# Altium project Bike_Comp.PrjPCB
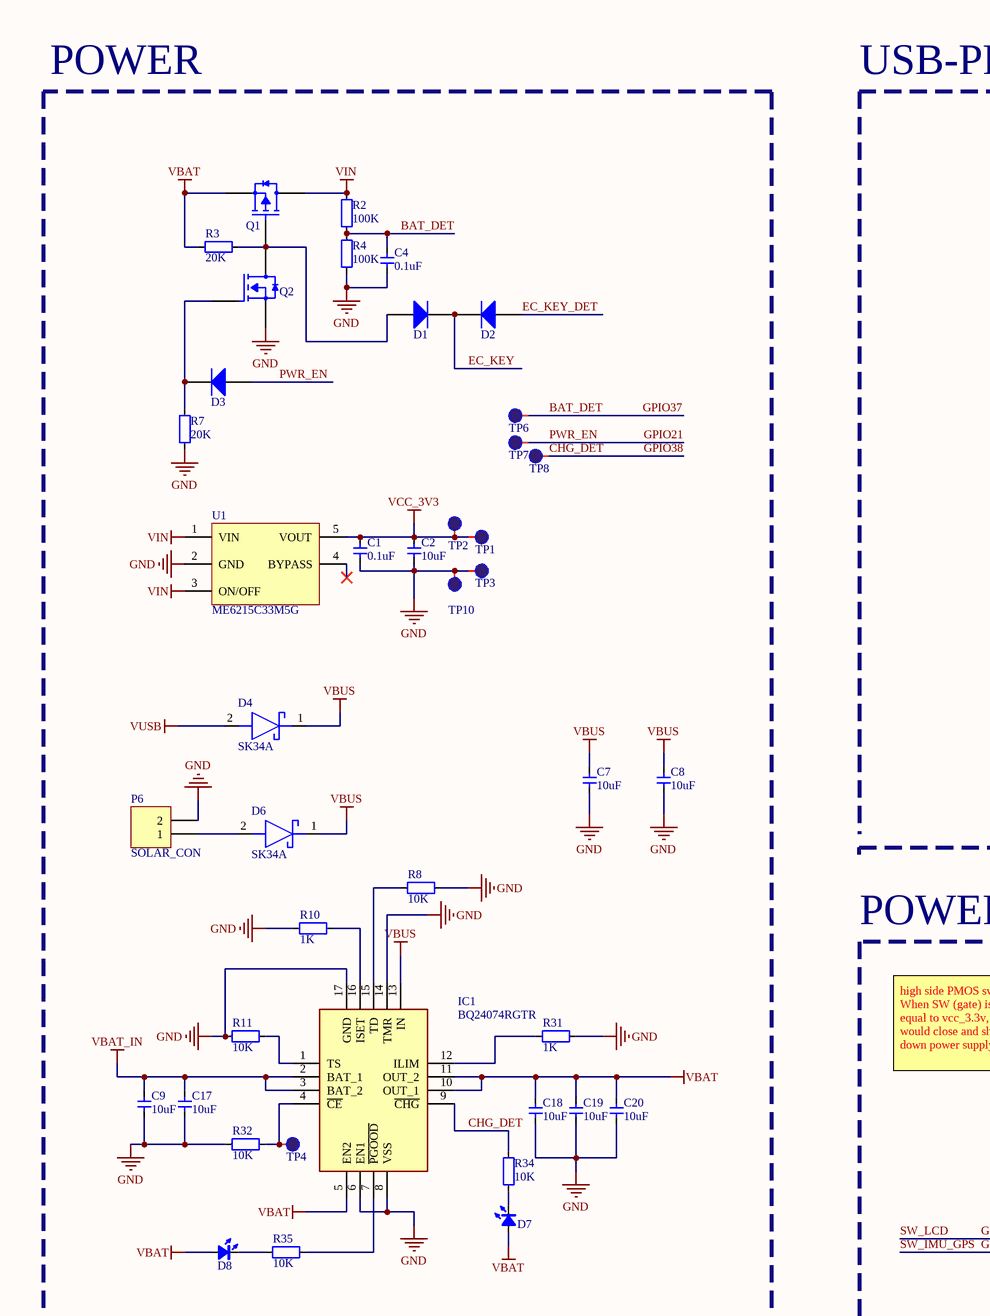
[diagram p0: Main.SchDoc, top left]
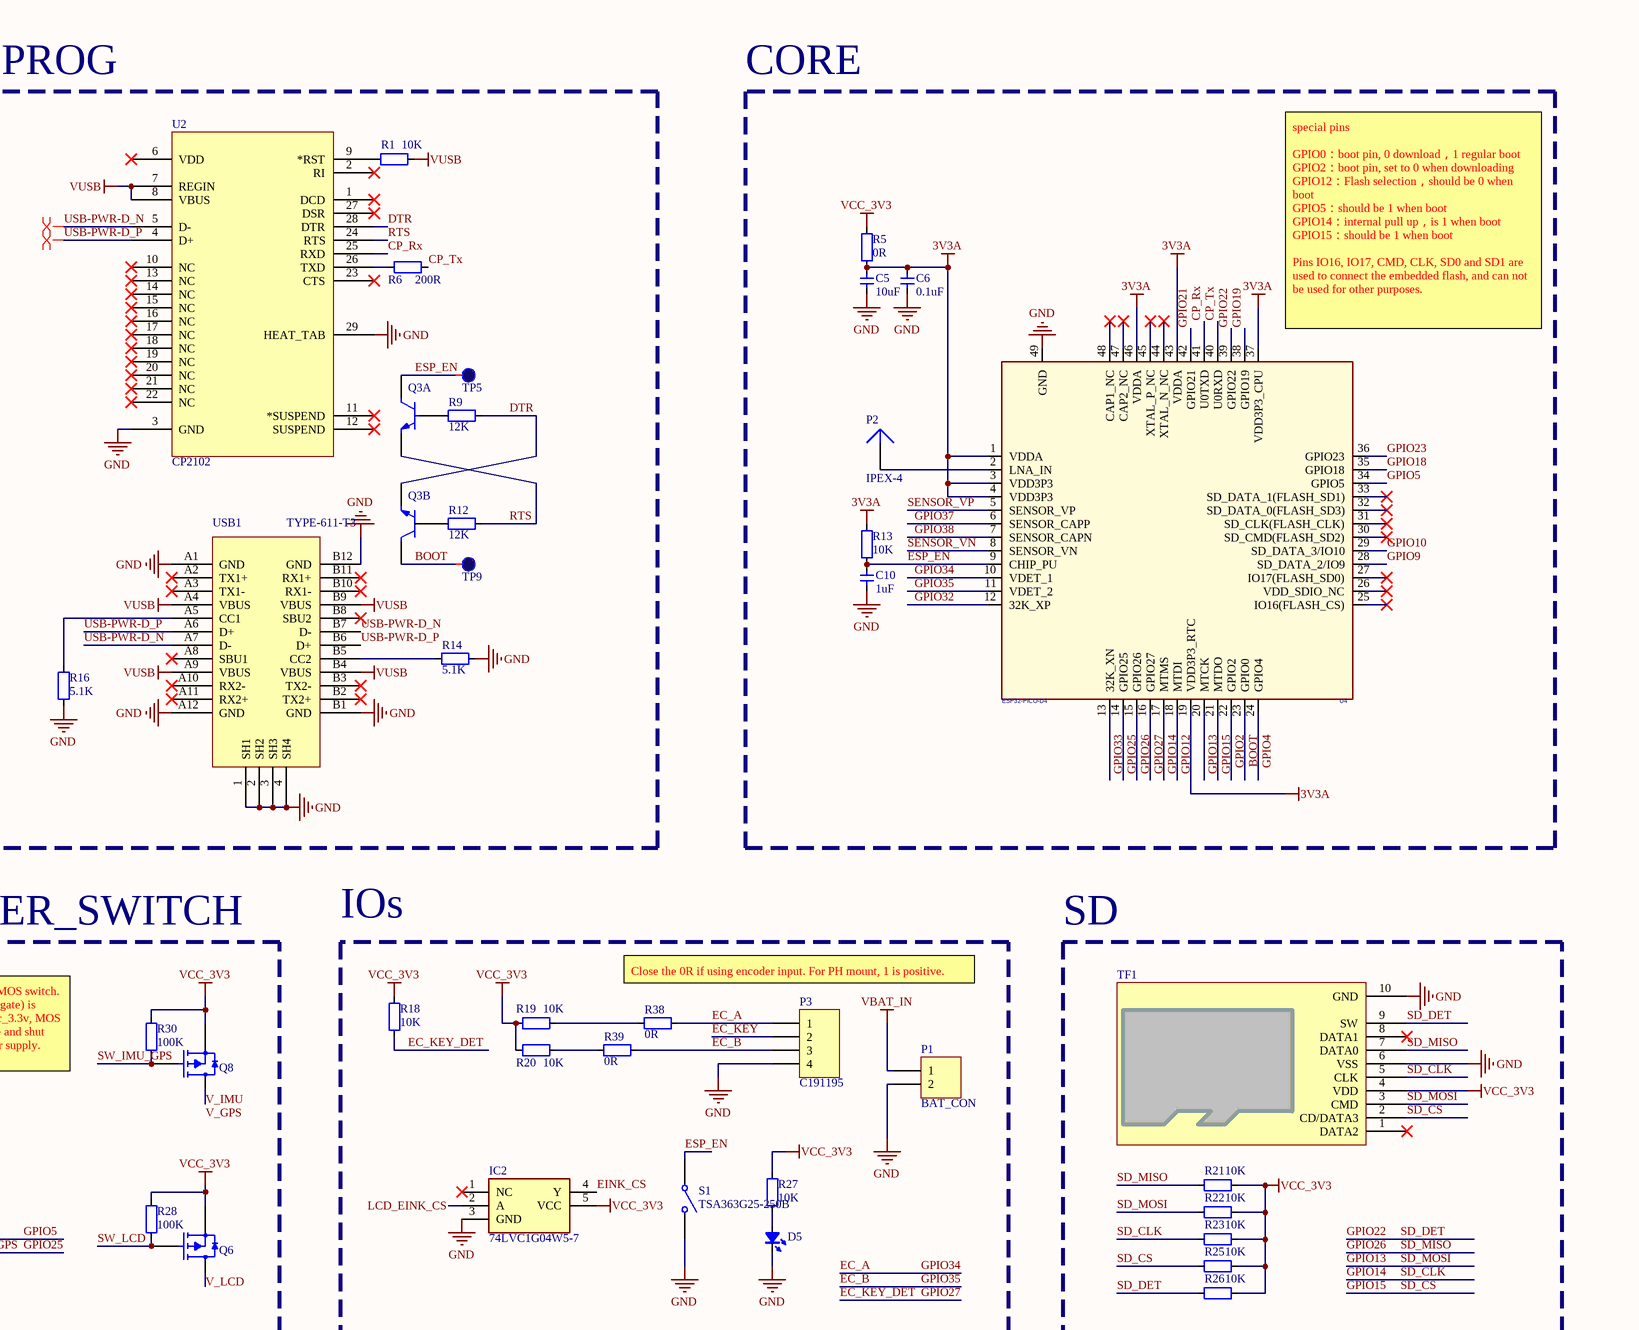
[diagram p1: Main.SchDoc, top right]
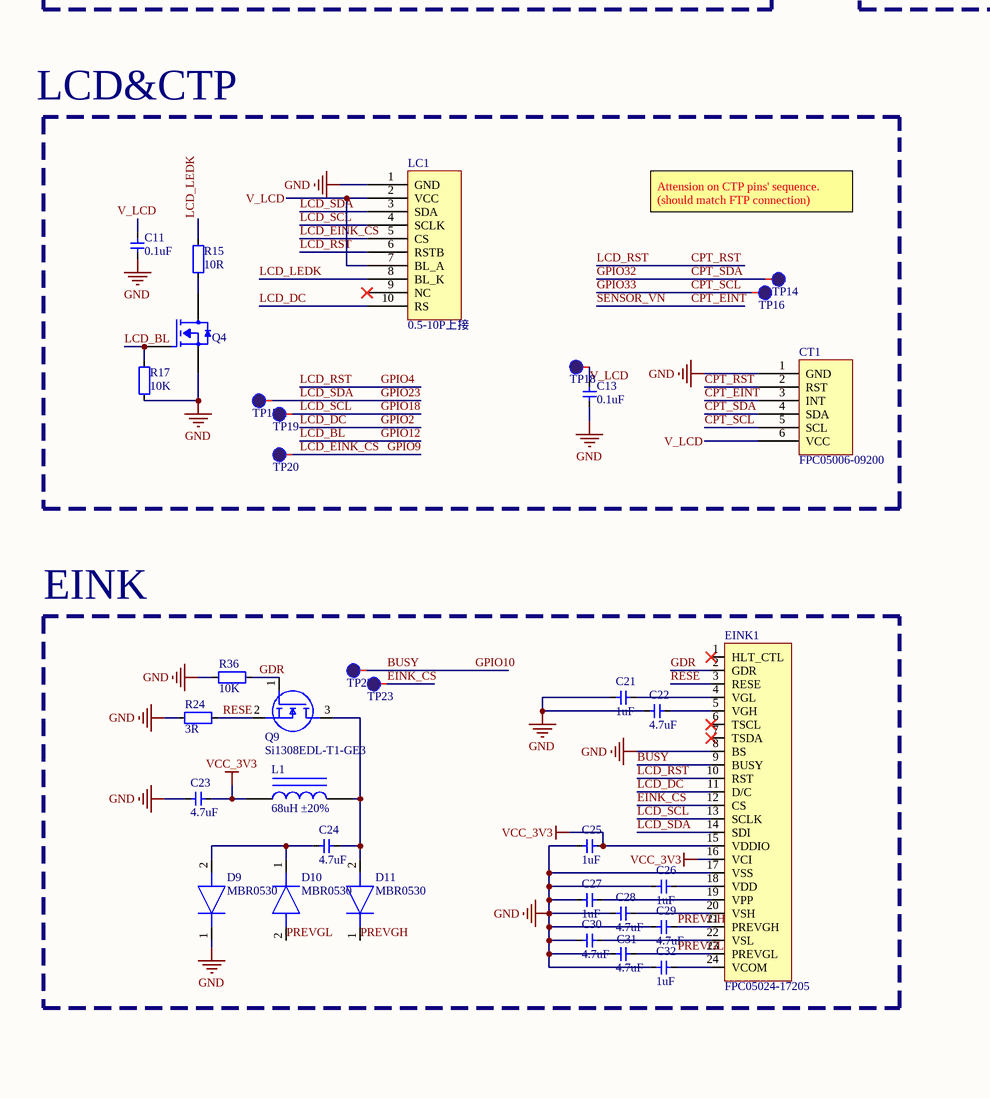
[diagram p2: Main.SchDoc, bottom left]
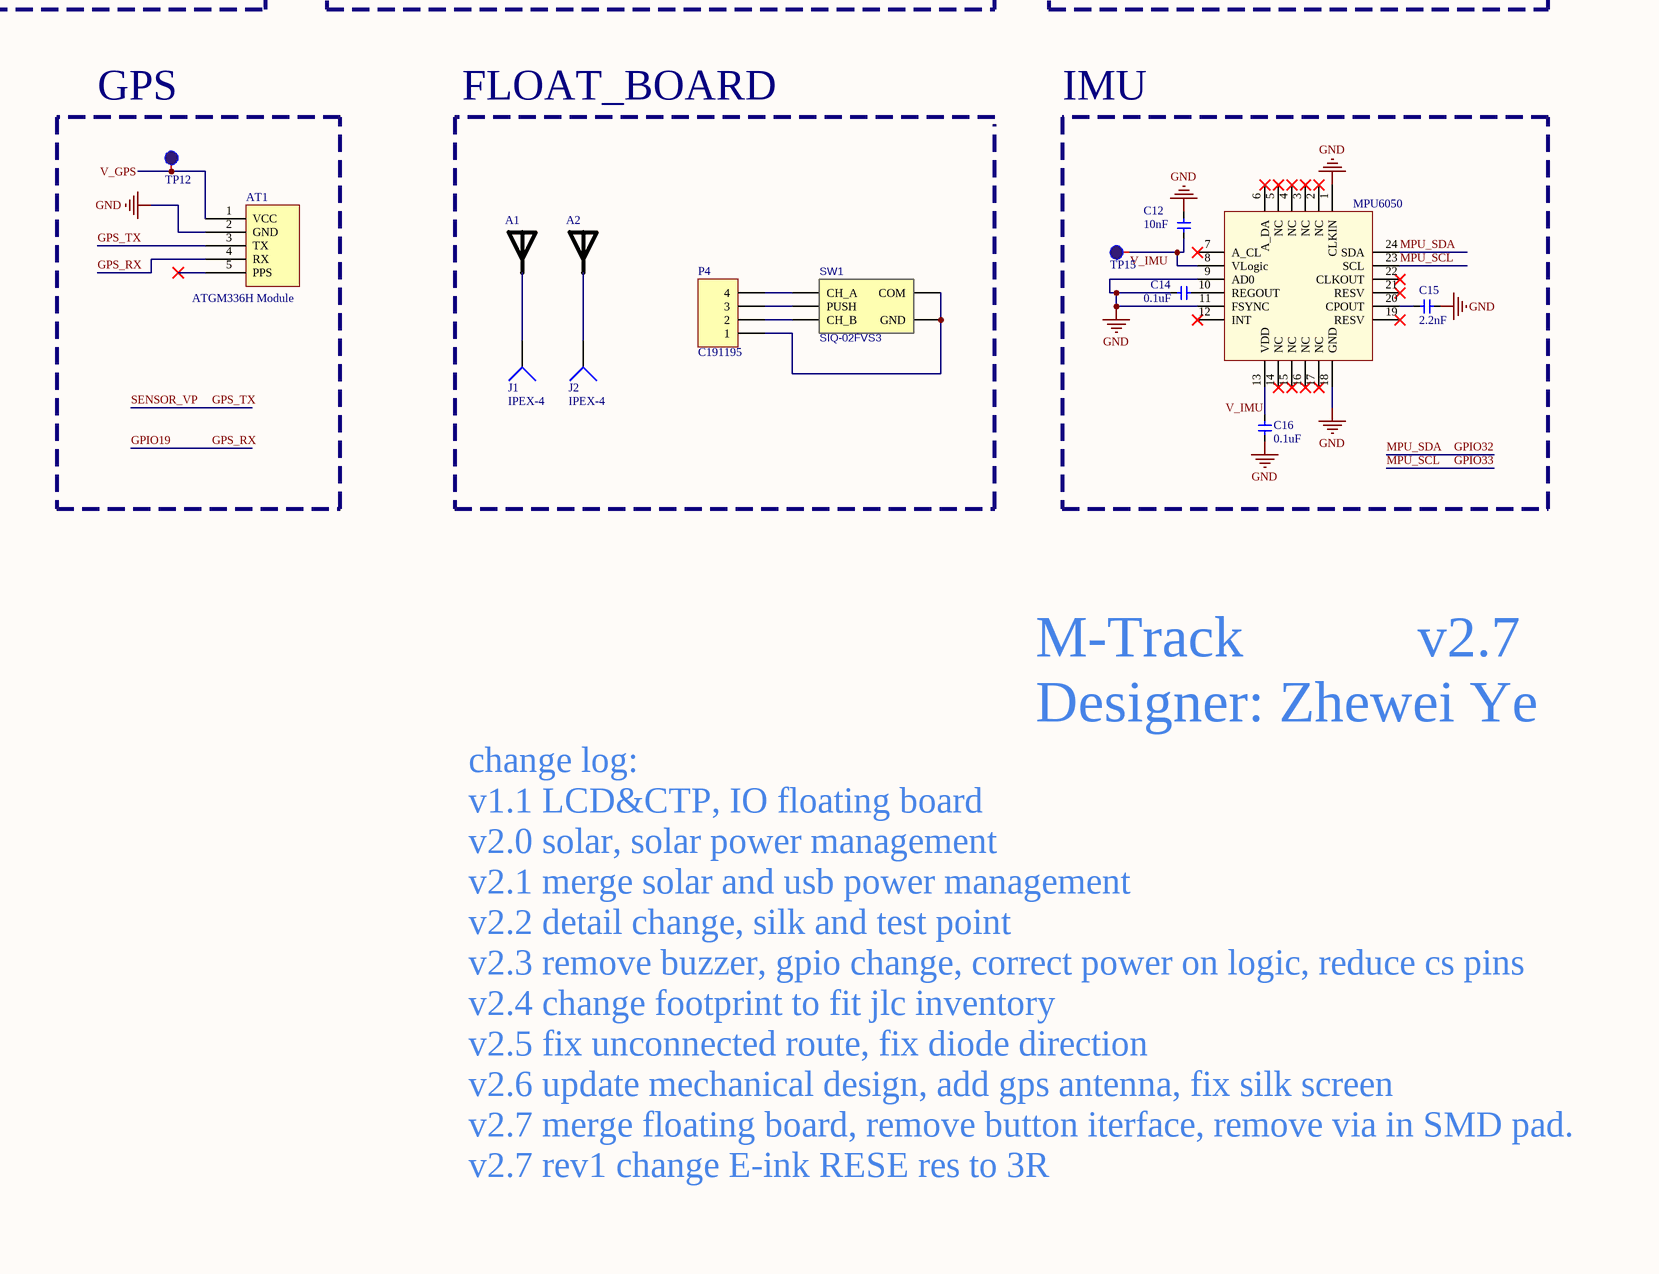
[diagram p3: Main.SchDoc, bottom right]
1 sheet, 129 parts. Net scope: global (net labels, ports and power ports of the same name join across sheets).
Board file: Peak_Track.PcbDoc

## Sheet Main.SchDoc
size OrCAD D; LCSC PART #: C52923

### Parts
A1  AN2051-245  [ANT-Rainsun-AN5120]  (value not drawn)
A2  AN2051-245  [ANT-Rainsun-AN5120]  (value not drawn)
AT1  ATGM336H Module  [PCBComponent_1]
C1  0.1uF  [CAP_0402]
C2  10uF  [CAP_0402]
C4  0.1uF  [CAP_0402]
C5  10uF  [CAP_0402]
C6  0.1uF  [CAP_0402]
C7  10uF  [CAP_0402]
C8  10uF  [CAP_0402]
C9  10uF  [CAP_0402]
C10  1uF  [CAP_0402]
C11  0.1uF  [CAP_0402]
C12  10nF  [CAP_0402]
C13  0.1uF  [CAP_0402]
C14  0.1uF  [CAP_0402]
C15  2.2nF  [CAP_0402]
C16  0.1uF  [CAP_0402]
C17  10uF  [CAP_0402]
C18  10uF  [CAP_0402]
C19  10uF  [CAP_0402]
C20  10uF  [CAP_0402]
C21  1uF  [CAP_0402]
C22  4.7uF  [CAP_0402]
C23  4.7uF  [CAP_0402]
C24  4.7uF  [CAP_0402]
C25  1uF  [CAP_0402]
C26  1uF  [CAP_0402]
C27  1uF  [CAP_0402]
C28  4.7uF  [CAP_0402]
C29  4.7uF  [CAP_0402]
C30  4.7uF  [CAP_0402]
C31  4.7uF  [CAP_0402]
C32  1uF  [CAP_0402]
CT1  FPC05006-09200  [FPC0.5-WT-6P]
D1  B5819W  [SOD-323]  (value not drawn)
D2  B5819W  [SOD-323]  (value not drawn)
D3  B5819W  [SOD-323]  (value not drawn)
D4  SK34A  [SMA]
D5  LTST-C281KGKT  [LED_0402_RED]  (value not drawn)
D6  SK34A  [SMA]
D7  16-213/SDRC/S530-A3/TR8  [LED_0402_RED]  (value not drawn)
D8  LTST-C281KGKT  [LED_0402_RED]  (value not drawn)
D9  MBR0530  [SOD3716X135N]
D10  MBR0530  [SOD3716X135N]
D11  MBR0530  [SOD3716X135N]
EINK1  FPC05024-17205  [FPC0.5-WT-24P]
IC1  BQ24074RGTR  [QFN50P300X300X100-17N-D]
IC2  74LVC1G04W5-7  [SOT95P285X140-5N]
J1  IPEX-4  [COAXIAL/SMD/CON/V/I-PEX/W08-5801]
J2  IPEX-4  [COAXIAL/SMD/CON/V/I-PEX/W08-5801]
L1  68uH ±20%  [SWPA3015]
LC1  0.5-10P上接  [FPC0.5-WT-10P]
P1  BAT_CON  [PH2.0-W-2P]
P2  IPEX-4  [COAXIAL/SMD/CON/V/I-PEX/W08-5801]
P3  C191195  [FPC0.5-WT-4P]
P4  C191195  [FPC0.5-WT-4P]
P6  SOLAR_CON  [PH2.0-W-2P]
Q1  AO3401A  [SOT23-3]  (value not drawn)
Q2  AO3400A  [SOT23-3]  (value not drawn)
Q3  EMX1T2R  [SOT563-6]  (value not drawn)  (parts A,B of 2)
Q4  AO3400A  [SOT23-3]  (value not drawn)
Q6  AO3401A  [SOT23-3]  (value not drawn)
Q8  AO3401A  [SOT23-3]  (value not drawn)
Q9  Si1308EDL-T1-GE3  [SOT65P210X110-3N]
R1  10K  [RES_0402]
R2  100K  [RES_0402]
R3  20K  [RES_0402]
R4  100K  [RES_0402]
R5  0R  [RES_0402]
R6  200R  [RES_0402]
R7  20K  [RES_0402]
R8  10K  [RES_0402]
R9  12K  [RES_0402]
R10  1K  [RES_0402]
R11  10K  [RES_0402]
R12  12K  [RES_0402]
R13  10K  [RES_0402]
R14  5.1K  [RES_0402]
R15  10R  [RES_0402]
R16  5.1K  [RES_0402]
R17  10K  [RES_0402]
R18  10K  [RES_0402]
R19  10K  [RES_0402]
R20  10K  [RES_0402]
R21  10K  [RES_0402]
R22  10K  [RES_0402]
R23  10K  [RES_0402]
R24  3R  [RES_0402]
R25  10K  [RES_0402]
R26  10K  [RES_0402]
R27  10K  [RES_0402]
R28  100K  [RES_0402]
R30  100K  [RES_0402]
R31  1K  [RES_0402]
R32  10K  [RES_0402]
R34  10K  [RES_0402]
R35  10K  [RES_0402]
R36  10K  [RES_0402]
R38  0R  [RES_0402]
R39  0R  [RES_0402]
S1  TSA363G25-250B  [SW SMD-3*6*2.5]
SW1  SIQ-02FVS3  [SIQ-02FVS3]
TF1  TF-012D  [TF-SOCKET]  (value not drawn)
TP1  TP  [TP_SMD]  (value not drawn)
TP2  TP  [TEST 1]  (value not drawn)
TP3  TP  [TP_SMD]  (value not drawn)
TP4  TP  [TEST 1]  (value not drawn)
TP5  TP  [TEST 1]  (value not drawn)
TP6  TP  [TEST 1]  (value not drawn)
TP7  TP  [TEST 1]  (value not drawn)
TP8  TP  [TEST 1]  (value not drawn)
TP9  TP  [TEST 1]  (value not drawn)
TP10  TP  [TP_SMD]  (value not drawn)
TP12  TP  [TEST 1]  (value not drawn)
TP14  TP  [TEST 1]  (value not drawn)
TP15  TP  [TEST 1]  (value not drawn)
TP16  TP  [TEST 1]  (value not drawn)
TP17  TP  [TEST 1]  (value not drawn)
TP18  TP  [TEST 1]  (value not drawn)
TP19  TP  [TEST 1]  (value not drawn)
TP20  TP  [TEST 1]  (value not drawn)
TP22  TP  [TEST 1]  (value not drawn)
TP23  TP  [TEST 1]  (value not drawn)
U1  ME6215C33M5G  [SOT23-5]
U2  CP2102  [QFN-28]
U4  ESP32-PICO-D4  [QFN-48_7X7]
U5  MPU6050  [QFN-24]
USB1  TYPE-611-T3  [USB-C-SMD_16P]

### Blocks framed on the sheet
CORE: C5 C6 C10 P2 R5 R13 U4
POWER_SWITCH: Q6 Q8 R28 R30
IOs: D5 IC2 P1 P3 R18-R20 R27 R38 R39 S1
SD: R21-R23 R25 R26 TF1
GPS: AT1 TP12
IMU: C12 C14-C16 TP15 U5
EINK: C21-C32 D9-D11 EINK1 L1 Q9 R24 R36 TP22 TP23

### Nets
3V3A: C5.2 C6.2 R5.2 R13.1 U4.1(VDDA) U4.3(VDD3P3) U4.4(VDD3P3) U4.19(VDD3P3_RTC) U4.37(VDD3P3_CPU) U4.43(VDDA) U4.46(VDDA)
GND: AT1.2(GND) C1.1 C2.1 C4.1 C5.1 C6.1 C7.1 C8.1 C9.1 C10.2 C11.1 C12.2 C13.1 C14.2 C15.1 C16.1 C17.1 C18.1 C19.1 C20.1 C21.1 C22.1 C23.1 C25.1 C26.1 C27.1 C28.1 C29.1 C30.1 C31.1 C32.1 CT1.1(GND) D5.2(K) D9.1(K) EINK1.8(BS) EINK1.17(VSS) IC1.6(EN1) IC1.8(VSS) IC1.14(TMR) IC1.17(GND) IC2.3(GND) LC1.1(GND) P1.2 P3.4 P6.2 Q2.2(S) Q4.2(S) R4.1 R7.1 R8.1 R10.1 R11.2 R14.1 R16.2 R17.1 R24.1 R31.1 R32.2 R36.1 S1.2(NO) TF1.6(VSS) TF1.10(GND) TP3.0 TP10.0 U1.2(GND) U2.3(GND) U2.29(HEAT_TAB) U4.49(GND) U5.1(CLKIN) U5.9(AD0) U5.11(FSYNC) U5.18(GND) USB1.1(SH1) USB1.2(SH2) USB1.3(SH3) USB1.4(SH4) USB1.A1(GND) USB1.A12(GND) USB1.B1(GND) USB1.B12(GND)
VBAT: C18.2 C19.2 C20.2 D7.1(A) D8.1(A) IC1.5(EN2) IC1.10(OUT_1) IC1.11(OUT_2) Q1.2(S) R3.1
VBAT_IN: C9.2 C17.2 IC1.2(BAT_1) IC1.3(BAT_2) P1.1
VBUS: C7.2 C8.2 D4.1(K) D6.1(K) IC1.13(IN)
VCC_3V3: C1.2 C2.2 C23.2 C25.2 EINK1.15(VDDIO) EINK1.16(VCI) IC2.5(VCC) L1.1 Q6.2(S) Q8.2(S) R5.1 R18.1 R19.2 R20.2 R21.1 R22.1 R23.1 R25.1 R26.1 R27.2 R28.2 R30.2 TF1.4(VDD) TP1.0 TP2.0 U1.5(VOUT)
VIN: Q1.3(D) R2.2 U1.1(VIN) U1.3(ON/OFF)
VUSB: D4.2(A) R1.1 U2.7(REGIN) U2.8(VBUS) USB1.A4(VBUS) USB1.A9(VBUS) USB1.B4(VBUS) USB1.B9(VBUS)
BAT_DET: C4.2 R2.1 R4.2 TP6.0 U4.6(SENSOR_CAPP)  [also labelled GPIO37]
BOOT: Q3.3(C2) TP9.0 U4.23(GPIO0)
BUSY: EINK1.9(BUSY) TP22.0 U4.29(SD_DATA_3/IO10)  [also labelled GPIO10]
CHG_DET: IC1.9(~{CHG}) R34.2 TP8.0 U4.7(SENSOR_CAPN)  [also labelled GPIO38]
CP_Rx: U2.25(RXD) U4.41(U0TXD)
CP_Tx: R6.1 U4.40(U0RXD)
CPT_EINT: CT1.3(INT) U4.8(SENSOR_VN)  [also labelled SENSOR_VN]
CPT_RST: CT1.2(RST) EINK1.10(RST) LC1.6(RSTB) U4.24(GPIO4)  [also labelled GPIO4, LCD_RST]
CPT_SCL: CT1.5(SCL) TP16.0 U4.13(32K_XN) U5.23(SCL)  [also labelled GPIO33, MPU_SCL]
CPT_SDA: CT1.4(SDA) TP14.0 U4.12(32K_XP) U5.24(SDA)  [also labelled GPIO32, MPU_SDA]
DTR: Q3.4(E2) R9.1 U2.28(DTR)
EC_A: P3.1 R38.2 U4.10(VDET_1)  [also labelled GPIO34]
EC_B: P3.3 R39.2 U4.11(VDET_2)  [also labelled GPIO35]
EC_KEY: D1.2(K) D2.2(K) P3.2
EC_KEY_DET: D2.1(A) R18.2 U4.16(GPIO27)  [also labelled GPIO27]
EINK_CS: EINK1.12(CS) IC2.4(Y) TP23.0
ESP_EN: C10.1 Q3.6(C1) R13.2 S1.1(COMMON) TP5.0 U4.9(CHIP_PU)
GDR: EINK1.2(GDR) Q9.1(G) R36.2
GPIO2: EINK1.11(D/C) LC1.10(RS) U4.22(GPIO2)  [also labelled LCD_DC]
GPIO5: Q6.1(G) R28.1 U4.34(GPIO5)  [also labelled SW_LCD]
GPIO9: IC2.2(A) LC1.5(CS) TP20.0 U4.28(SD_DATA_2/IO9)  [also labelled LCD_EINK_CS]
GPIO12: Q4.1(G) R17.2 U4.18(MTDI)  [also labelled LCD_BL]
GPIO13: R22.2 TF1.3(CMD) U4.20(MTCK)  [also labelled SD_MOSI]
GPIO14: R23.2 TF1.5(CLK) U4.17(MTMS)  [also labelled SD_CLK]
GPIO15: R25.2 TF1.2(CD/DATA3) U4.21(MTDO)  [also labelled SD_CS]
GPIO18: EINK1.13(SCLK) LC1.4(SCLK) TP19.0 U4.35(GPIO18)  [also labelled LCD_SCL]
GPIO19: AT1.4(RX) U4.38(GPIO19)  [also labelled GPS_RX]
GPIO21: D3.1(A) TP7.0 U4.42(GPIO21)  [also labelled PWR_EN]
GPIO22: R26.2 TF1.9(SW) U4.39(GPIO22)  [also labelled SD_DET]
GPIO23: EINK1.14(SDI) LC1.3(SDA) TP17.0 U4.36(GPIO23)  [also labelled LCD_SDA]
GPIO25: Q8.1(G) R30.1 U4.14(GPIO25)  [also labelled SW_IMU_GPS]
GPIO26: R21.2 TF1.7(DATA0) U4.15(GPIO26)  [also labelled SD_MISO]
GPS_TX: AT1.3(TX) U4.5(SENSOR_VP)  [also labelled SENSOR_VP]
LCD_LEDK: LC1.8(BL_K) R15.2
PREVGH: C29.2 D11.1(K) EINK1.21(PREVGH)
PREVGL: C31.2 D10.2(A) EINK1.23(PREVGL)
RESE: EINK1.3(RESE) Q9.2(S) R24.2
RTS: Q3.1(E1) R12.1 U2.24(RTS)
USB-PWR-D_N: U2.5(D-) USB1.A7(D-) USB1.B7(D-)
USB-PWR-D_P: U2.4(D+) USB1.A6(D+) USB1.B6(D+)
V_GPS: AT1.1(VCC) C12.1 C16.2 Q8.3(D) TP12.0 TP15.0 U5.8(VLogic) U5.13(VDD)  [also labelled V_IMU]
V_LCD: C11.2 C13.2 CT1.6(VCC) LC1.2(VCC) LC1.7(BL_A) Q6.3(D) TP18.0
NetA1_1: A1.1 J1.1
NetA2_1: A2.1 J2.1
NetC14_1: C14.1 U5.10(REGOUT)
NetC15_2: C15.2 U5.20(CPOUT)
NetC21_2: C21.2 EINK1.4(VGL)
NetC22_2: C22.2 EINK1.5(VGH)
NetC24_1: C24.1 D9.2(A) D10.1(K)
NetC24_2: C24.2 D11.2(A) L1.2 Q9.3(D)
NetC26_2: C26.2 EINK1.18(VDD)
NetC27_2: C27.2 EINK1.19(VPP)
NetC28_2: C28.2 EINK1.20(VSH)
NetC30_2: C30.2 EINK1.22(VSL)
NetC32_2: C32.2 EINK1.24(VCOM)
NetD1_1: D1.1(A) Q1.1(G) Q2.3(D) R3.2
NetD3_2: D3.2(K) Q2.1(G) R7.2
NetD5_1: D5.1(A) R27.1
NetD6_2: D6.2(A) P6.1
NetD7_2: D7.2(K) R34.1
NetD8_2: D8.2(K) R35.1
NetIC1_1: IC1.1(TS) R11.1
NetIC1_4: IC1.4(~{CE}) R32.1 TP4.0
NetIC1_7: IC1.7(~{PGOOD}) R35.2
NetIC1_12: IC1.12(ILIM) R31.2
NetIC1_15: IC1.15(TD) R8.2
NetIC1_16: IC1.16(ISET) R10.2
NetP2_1: P2.1 U4.2(LNA_IN)
NetP4_1: P4.1 SW1.3(COM) SW1.5(GND)
NetP4_2: P4.2 SW1.4(CH_B)
NetP4_3: P4.3 SW1.2(PUSH)
NetP4_4: P4.4 SW1.1(CH_A)
NetQ3_2: Q3.2(B1) R9.2
NetQ3_5: Q3.5(B2) R12.2
NetQ4_3: Q4.3(D) R15.1
NetR1_2: R1.2 U2.9(*RST)
NetR6_2: R6.2 U2.26(TXD)
NetR14_2: R14.2 USB1.B5(CC2)
NetR16_1: R16.1 USB1.A5(CC1)
NetR19_1: R19.1 R38.1
NetR20_1: R20.1 R39.1

Not connected (* = marked no-connect by the designer): AT1 5(PPS)*; EINK1 1(HLT_CTL)* 6(TSCL)* 7(TSDA)*; IC2 1(NC)*; LC1 9(NC)*; TF1 1(DATA2)* 8(DATA1)*; U1 4(BYPASS)*; U2 1(DCD)* 2(RI)* 6(VDD)* 10(NC)* 11(*SUSPEND)* 12(SUSPEND)* 13(NC)* 14(NC)* 15(NC)* 16(NC)* 17(NC)* 18(NC)* 19(NC)* 20(NC)* 21(NC)* 22(NC)* 23(CTS)* 27(DSR)*; U4 25(IO16(FLASH_CS))* 26(VDD_SDIO_NC)* 27(IO17(FLASH_SD0))* 30(SD_CMD(FLASH_SD2))* 31(SD_CLK(FLASH_CLK))* 32(SD_DATA_0(FLASH_SD3))* 33(SD_DATA_1(FLASH_SD1))* 44(XTAL_N_NC)* 45(XTAL_P_NC)* 47(CAP2_NC)* 48(CAP1_NC)*; U5 2(NC)* 3(NC)* 4(NC)* 5(NC)* 6(A_DA)* 7(A_CL)* 12(INT)* 14(NC)* 15(NC)* 16(NC)* 17(NC)* 19(RESV)* 21(RESV)* 22(CLKOUT)*; USB1 A2(TX1+)* A3(TX1-)* A8(SBU1)* A10(RX2-)* A11(RX2+)* B2(TX2+)* B3(TX2-)* B8(SBU2)* B10(RX1-)* B11(RX1+)*

### Layout directives
differential pair: USB-PWR-D_N, USB-PWR-D_P

### Notes on the sheet
- POWER
- USB-PROG
- (near U4) special pins
  GPIO0：boot pin, 0 download，1 regular boot
  GPIO2：boot pin, set to 0 when downloading
  GPIO12：Flash selection，should be 0 when boot
  GPIO5：should be 1 when boot
  GPIO14：internal pull up，is 1 when boot
  GPIO15：should be 1 when boot
  Pins IO16, IO17, CMD, CLK, SD0 and SD1 are used to connect the embedded flash, and can not be used for other purposes.
- Close the 0R if using encoder input. For PH mount, 1 is positive.
- high side PMOS switch. When SW (gate) is equal to vcc_3.3v, MOS would close and shut down power supply.
- LCD&CTP
- FLOAT_BOARD
- Attension on CTP pins' sequence. (should match FTP connection)
- M-Track            v2.7
  Designer: Zhewei Ye
- change log:
  v1.1 LCD&CTP, IO floating board
  v2.0 solar, solar power management
  v2.1 merge solar and usb power management
  v2.2 detail change, silk and test point
  v2.3 remove buzzer, gpio change, correct power on logic, reduce cs pins
  v2.4 change footprint to fit jlc inventory
  v2.5 fix unconnected route, fix diode direction
  v2.6 update mechanical design, add gps antenna, fix silk screen
  v2.7 merge floating board, remove button iterface, remove via in SMD pad.
  v2.7 rev1 change E-ink RESE res to 3R

### Library data of the parts
A1 A2 = ANT-Rainsun-AP5120: footprint: 2051; LCSC PART #: C99727
C1 C2 C4-C32 = 电容-0402: Capacitor; Value: 0.1u
  C10 C21 C25-C27 C32: LCSC PART #: C52923
CT1 = CTP: 下接6p
D1-D3 = 二极管-5819W: 40V; LCSC PART #: C8598
D4 D6 = SK34AFL-TP: GOOD_ARK Schottky Diode; pin to pad: 1>2 2>1; Manufacturer_Name: Micro Commercial Components (MCC); Datasheet Link: https://www.mouser.de/datasheet/2/258/SK32AFL_SK310AFL_DO_221AC_-2492378.pdf; Height: 1.25mm; Manufacturer_Part_Number: SK34AFL-TP; Mouser Part Number: 833-SK34AFL-TP; Mouser Price/Stock: https://www.mouser.co.uk/ProductDetail/Micro-Commercial-Components-MCC/SK34AFL-TP?qs=%2F9jDaHz9Z2hx3laGbsEE%252BA%3D%3D; Arrow Part Number: SK34AFL-TP; Arrow Price/Stock: https://www.arrow.com/en/products/sk34afl-tp/micro-commercial-components?region=europe; LCSC PART #: C85269
D5 D8 = LED_0402: GREEN_LED; Type: 0402; Value: color?; LCSC PART #: C160479
D7 = LED_0402: RED_LED; Type: 0402; Value: color?; LCSC PART #: C71911
D9-D11 = MBR0530: Diode; Manufacturer_Name: onsemi; Datasheet Link: http://www.onsemi.com/pub/Collateral/MBR0530T1-D.PDF; Height: 1.35mm; Manufacturer_Part_Number: MBR0530; Mouser Part Number: 512-MBR0530; Mouser Price/Stock: https://www.mouser.co.uk/ProductDetail/ON-Semiconductor-Fairchild/MBR0530?qs=VOMQJJE%252BBNniwJKcE3T43Q%3D%3D; Arrow Part Number: MBR0530; Arrow Price/Stock: https://www.arrow.com/en/products/mbr0530/on-semiconductor?region=nac; LCSC PART #: C77336
EINK1 = EINK: 上接24p; pin to pad: 1>24 2>23 3>22 4>21 5>20 6>19 7>18 8>17 9>16 10>15 11>14 12>13 13>12 14>11 15>10 16>9 17>8 18>7 19>6 20>5 21>4 22>3 23>2 24>1
IC1 = BQ24074RGTR: Integrated Circuit; Manufacturer_Name: Texas Instruments; Datasheet Link: http://www.ti.com/lit/ds/symlink/bq24074.pdf; Height: 1mm; Manufacturer_Part_Number: BQ24074RGTR; Mouser Part Number: 595-BQ24074RGTR; Mouser Price/Stock: https://www.mouser.co.uk/ProductDetail/Texas-Instruments/BQ24074RGTR?qs=ZV%2Fxhq4oszp2Nll7fIx5wg%3D%3D; Arrow Part Number: BQ24074RGTR; Arrow Price/Stock: https://www.arrow.com/en/products/bq24074rgtr/texas-instruments?region=nac
IC2 = 74LVC1G04W5-7: Integrated Circuit; Manufacturer_Name: Diodes Inc.; Datasheet Link: https://www.diodes.com/assets/Datasheets/74LVC1G04.pdf; Height: 1.4mm; Manufacturer_Part_Number: 74LVC1G04W5-7; Mouser Part Number: 621-74LVC1G04W5-7; Mouser Price/Stock: https://www.mouser.co.uk/ProductDetail/Diodes-Incorporated/74LVC1G04W5-7?qs=8Dv1RiiPiVJr3C1LRLmsKw%3D%3D; Arrow Part Number: 74LVC1G04W5-7; Arrow Price/Stock: https://www.arrow.com/en/products/74lvc1g04w5-7/diodes-incorporated?region=nac
J1 J2 = Socket: LatestRevisionDate: 17-Jul-2002; LatestRevisionNote: Re-released for DXP Platform.; Publisher: Altium Limited
L1 = Inductor Iron: Magnetic-Core Inductor; Published: 24-Mar-1999; LatestRevisionDate: 17-Jul-2002; LatestRevisionNote: Re-released for DXP Platform.; PackageReference: AXIAL-0.9; Publisher: Altium Limited; PackageDescription: Axial Device, Thru-Hole; 2 Leads; 0.9 in Pin Spacing; Value: 68uH; LCSC PART #: C2925423
LC1 = LCD: 上接10p; LCSC PART #: C11085
P1 P6 = Header 2: PH2.0-2P-LT; LatestRevisionDate: 17-Jul-2002; LatestRevisionNote: Re-released for DXP Platform.; Publisher: Altium Limited
P2 = Plug: LatestRevisionDate: 17-Jul-2002; LatestRevisionNote: Re-released for DXP Platform.; Publisher: Altium Limited
P3 P4 = Header 4: Header, 4-Pin; LatestRevisionDate: 17-Jul-2002; LatestRevisionNote: Re-released for DXP Platform.; Publisher: Altium Limited; LCSC PART #: C191195
Q1 Q6 Q8 = AO3401A: P-MOS; LCSC PART #: C15127
Q2 Q4 = AO3400A: N-MOS
Q3 = BC847BVC-7
Q9 = Si1308EDL-T1-GE3: MOSFET (N-Channel); Manufacturer_Name: Vishay; Datasheet Link: https://componentsearchengine.com/Datasheets/1/SI1308EDL-T1-GE3.pdf; Height: 1.1mm; Manufacturer_Part_Number: Si1308EDL-T1-GE3; Mouser Part Number: 78-SI1308EDL-T1-GE3; Mouser Price/Stock: https://www.mouser.co.uk/ProductDetail/Vishay-Semiconductors/SI1308EDL-T1-GE3?qs=bX1%252BNvsK%2FBramh9tgpOaEw%3D%3D; Arrow Part Number: SI1308EDL-T1-GE3; Arrow Price/Stock: https://www.arrow.com/en/products/si1308edl-t1-ge3/vishay?region=nac; LCSC PART #: LCSC PART #
R1-R28 R30-R32 R34-R36 R38 R39 = 电阻-0402: Resistor; Value: 22R
  R9 R12: LCSC PART #: C25752; Parameter 1: *
  R15: LCSC PART #: C25077
S1 = SW-SPST: Single-Pole, Single-Throw Switch; Published: 24-Mar-1999; LatestRevisionDate: 17-Jul-2002; LatestRevisionNote: Re-released for DXP Platform.; PackageReference: SPST-2; Publisher: Altium Limited; PackageDescription: Switch; 2 Leads
SW1 = Rotary Encoder: BOM_Manufacturer: ALPSALPINE; BOM_Manufacturer Part: EC11E1534443; Contributor: LCSC; BOM_Supplier: LCSC; BOM_Supplier Part: C1322543; BOM_JLCPCB Part Class: Extended Part; spicePre: S; spiceSymbolName: EC11E1534443; LCSC PART #: C2925423
TF1 = TF卡座: 8脚自弹
TP1-TP10 TP12 TP14-TP20 TP22 TP23 = TP: pin to pad: 0>1
U1 = LP2992: LDO module changed, BYPASS now is NC
U2 = CP2102: USB转TTL; PART DESC: SINGLE-CHIP USB TO UART BRIDGE, QFN28, RoHS.; MFG #1: SILICON LABS; PART NUMBER: CP2102; Value: Value; RefDes: RefDes; Type: DEV
U4 = ESP32-PICO: LCSC PART #: C193707
U5 = MPU6050: 六轴传感器; LCSC PART #: C24112
USB1 = USB-Type-C-TOP: 16pin